# EAGLE design adapterSchematic (EAGLE 9.6.2)
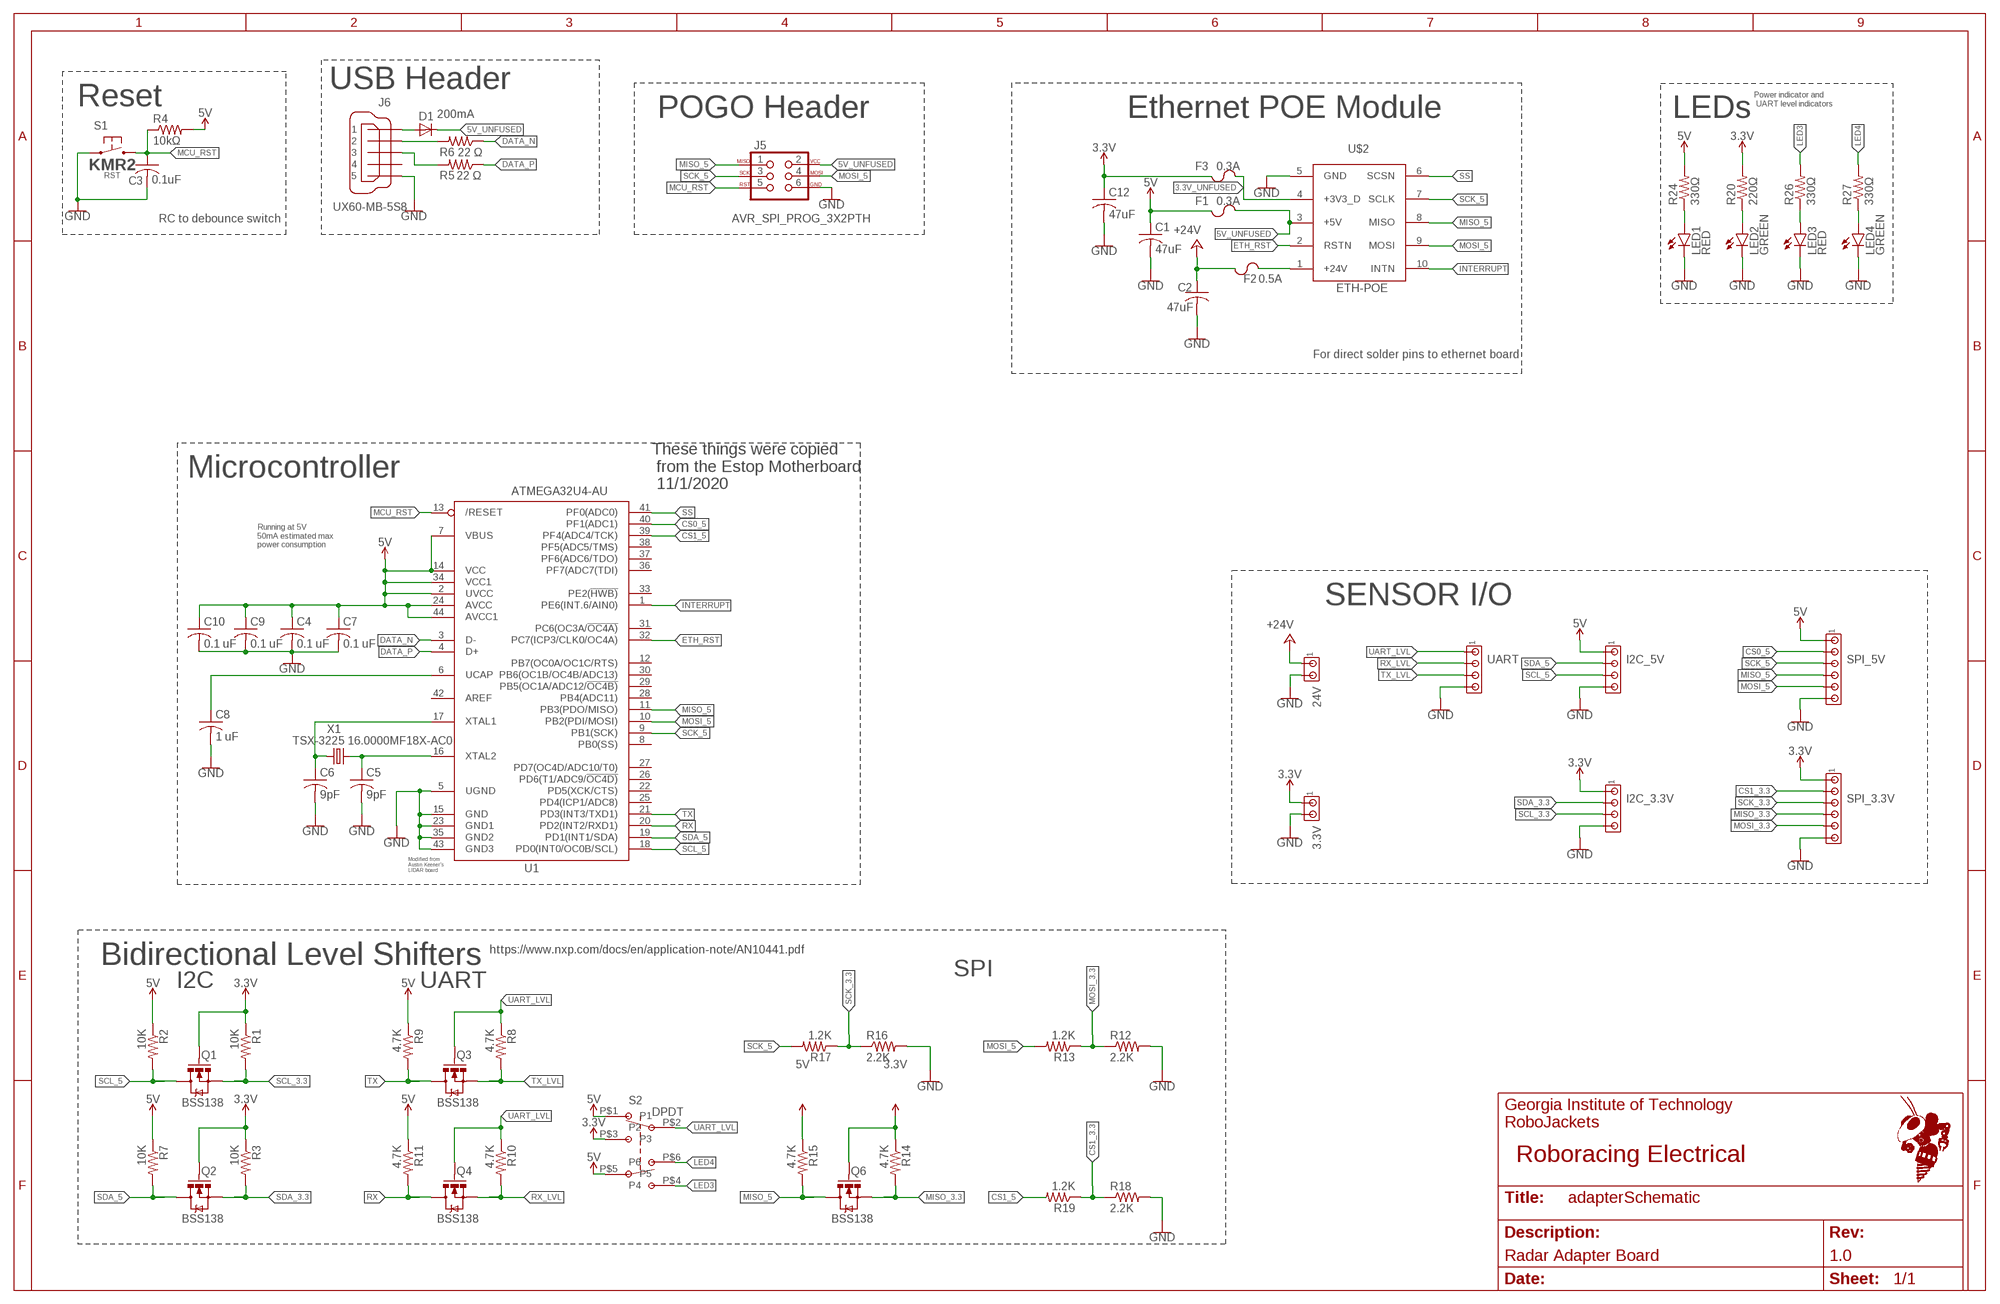
[diagram p0: schematic, sheet 1]
FRAME1 (FRAME_11_17): REVISION: 1.0; SCH_DESC: Radar Adapter Board; TEAM: Roboracing Electrical

## Parts
3.3V  MTA02-100  [10X02MTA]
24V  MTA02-100  [10X02MTA]
C1  47uF  C-USC1206  [C1206]
C2  47uF  C-USC1206  [C1206]
C3  0.1uF  C-USC0603  [C0603]
C4  0.1 uF  C-USC0603  [C0603]
C5  9pF  C-USC0603  [C0603]
C6  9pF  C-USC0603  [C0603]
C7  0.1 uF  C-USC0603  [C0603]
C8  1 uF  C-USC0603  [C0603]
C9  0.1 uF  C-USC0603  [C0603]
C10  0.1 uF  C-USC0603  [C0603]
C12  47uF  C-USC1206  [C1206]
D1  200mA  DIODE-SOD323-R  [SOD323-R]
F1  0.3A  CHIP_FUSE1206  [F1206]
F2  0.5A  CHIP_FUSE1206  [F1206]
F3  0.3A  CHIP_FUSE1206  [F1206]
I2C_3.3V  MTA04-100  [10X04MTA]
I2C_5V  MTA04-100  [10X04MTA]
J5  AVR_SPI_PROG_3X2PTH  [2X3]
J6  UX60-MB-5S8  [UX60-MB-5S8]
LED1  RED  LEDCHIP-LED0603  [CHIP-LED0603]
LED2  GREEN  LEDCHIP-LED0603  [CHIP-LED0603]
LED3  RED  LEDCHIP-LED0603  [CHIP-LED0603]
LED4  GREEN  LEDCHIP-LED0603  [CHIP-LED0603]
Q1  BSS138  MOSFET-NCHANNELSMD  [SOT23-3]
Q2  BSS138  MOSFET-NCHANNELSMD  [SOT23-3]
Q3  BSS138  MOSFET-NCHANNELSMD  [SOT23-3]
Q4  BSS138  MOSFET-NCHANNELSMD  [SOT23-3]
Q6  BSS138  MOSFET-NCHANNELSMD  [SOT23-3]
R1  10K  RESISTOR0603-RES  [0603-RES]
R2  10K  RESISTOR0603-RES  [0603-RES]
R3  10K  RESISTOR0603-RES  [0603-RES]
R4  10kΩ  R-US_R0603  [R0603]
R5  22 Ω  R-US_R0603  [R0603]
R6  22 Ω  R-US_R0603  [R0603]
R7  10K  RESISTOR0603-RES  [0603-RES]
R8  4.7K  RESISTOR0603-RES  [0603-RES]
R9  4.7K  RESISTOR0603-RES  [0603-RES]
R10  4.7K  RESISTOR0603-RES  [0603-RES]
R11  4.7K  RESISTOR0603-RES  [0603-RES]
R12  2.2K  RESISTOR0603-RES  [0603-RES]
R13  1.2K  RESISTOR0603-RES  [0603-RES]
R14  4.7K  RESISTOR0603-RES  [0603-RES]
R15  4.7K  RESISTOR0603-RES  [0603-RES]
R16  2.2K  RESISTOR0603-RES  [0603-RES]
R17  1.2K  RESISTOR0603-RES  [0603-RES]
R18  2.2K  RESISTOR0603-RES  [0603-RES]
R19  1.2K  RESISTOR0603-RES  [0603-RES]
R20  220Ω  R-US_R0603  [R0603]
R24  330Ω  R-US_R0603  [R0603]
R26  330Ω  R-US_R0603  [R0603]
R27  330Ω  R-US_R0603  [R0603]
S1  KMR2  [KMR2]
SPI_3.3V  MTA06-100  [10X06MTA]
SPI_5V  MTA06-100  [10X06MTA]
U1  ATMEGA32U4-AU  [TQFP44]
U$2  ETH-POE  [HDRVR10W64P4000X254_2X5_1016X508X254B]
U$4  DPDT_SLIDE_SWITCH  [DPDT_SLIDE_SWITCH]
UART  MTA04-100  [10X04MTA]
X1  TSX-3225 16.0000MF18X-AC0  XTAL-3.2X2.5  [XTAL-3.2X2.5]

## Nets
3.3V: 3.3V.1 C12.1 F3.1 I2C_3.3V.1 Q1.1(G) Q2.1(G) Q6.1(G) R1.1 R3.1 R14.1 R20.2 SPI_3.3V.1 U$4.P$3(P3)
3.3V_UNFUSED: F3.2 U$2.4(+3V3_D)
5V [power]: C1.1 C4.1 C7.1 C9.1 C10.1 F1.1 I2C_5V.1 R2.1 R4.2 R7.1 R9.1 R11.1 R15.1 R24.2 SPI_5V.1 U1.2(UVCC) U1.7(VBUS) U1.14(VCC) U1.24(AVCC) U1.34(VCC1) U1.44(AVCC1) U$4.P$1(P1) U$4.P$5(P5)
5V_UNFUSED [power]: D1.C F1.2 J5.2 U$2.3(+5V)
24V_UNFUSED: F2.2 U$2.1(+24V)
+24V: 24V.1 C2.1 F2.1
CS0_5: SPI_5V.2 U1.40(PF1(ADC1))
CS1_3.3: R18.1 R19.1 SPI_3.3V.2
CS1_5: R19.2 U1.39(PF4(ADC4/TCK))
DATA_N: R6.1 U1.3(D-)
DATA_P [RF]: R5.1 U1.4(D+)
ETH_RST: U1.32(PC7(ICP3/CLK0/OC4A)) U$2.2(RSTN)
GND [power]: 3.3V.2 24V.2 C1.2 C2.2 C3.2 C4.2 C5.2 C6.2 C7.2 C8.2 C9.2 C10.2 C12.2 I2C_3.3V.4 I2C_5V.4 J5.6 J6.5 LED1.C LED2.C LED3.C LED4.C R12.2 R16.2 R18.2 S1.1.1 S1.1.2 SPI_3.3V.6 SPI_5V.6 U1.5(UGND) U1.15(GND) U1.23(GND1) U1.35(GND2) U1.43(GND3) U$2.5(GND) UART.4
INTERRUPT: U1.1(PE6(INT.6/AIN0)) U$2.10(INTN)
LED3: R26.2 U$4.P$4(P4)
LED4: R27.2 U$4.P$6(P6)
MCU_RST: C3.1 J5.5 R4.1 S1.2.1 S1.2.2 U1.13(/RESET)
MISO_3.3: Q6.2(S) R14.2 SPI_3.3V.4
MISO_5: J5.1 Q6.3(D) R15.2 SPI_5V.4 U1.11(PB3(PDO/MISO)) U$2.8(MISO)
MOSI_3.3: R12.1 R13.1 SPI_3.3V.5
MOSI_5: J5.4 R13.2 SPI_5V.5 U1.10(PB2(PDI/MOSI)) U$2.9(MOSI)
N$1: LED2.A R20.1
N$3: LED1.A R24.1
N$4: LED3.A R26.1
N$5: J6.2 R6.2
N$7: D1.A J6.1
N$8: LED4.A R27.1
N$11: J6.3 R5.2
RX: Q4.3(D) R11.2 U1.20(PD2(INT2/RXD1))
RX_LVL: Q4.2(S) R10.2 UART.2
SCK_3.3: R16.1 R17.1 SPI_3.3V.3
SCK_5: J5.3 R17.2 SPI_5V.3 U1.9(PB1(SCK)) U$2.7(SCLK)
SCL_3.3: I2C_3.3V.3 Q1.2(S) R1.2
SCL_5: I2C_5V.3 Q1.3(D) R2.2 U1.18(PD0(INT0/OC0B/SCL))
SDA_3.3: I2C_3.3V.2 Q2.2(S) R3.2
SDA_5: I2C_5V.2 Q2.3(D) R7.2 U1.19(PD1(INT1/SDA))
SS: U1.41(PF0(ADC0)) U$2.6(SCSN)
TX: Q3.3(D) R9.2 U1.21(PD3(INT3/TXD1))
TX_LVL: Q3.2(S) R8.2 UART.3
UART_LVL: Q3.1(G) Q4.1(G) R8.1 R10.1 U$4.P$2(P2) UART.1
UCAP: C8.1 U1.6(UCAP)
XTAL1: C6.1 U1.17(XTAL1) X1.1
XTAL2: C5.1 U1.16(XTAL2) X1.3
Unconnected: J6.4 U1.8(PB0(SS)) U1.12(PB7(OC0A/OC1C/RTS)) U1.22(PD5(XCK/CTS)) U1.25(PD4(ICP1/ADC8)) U1.26(PD6(T1/ADC9/!OC4D)) U1.27(PD7(OC4D/ADC10/T0)) U1.28(PB4(ADC11)) U1.29(PB5(OC1A/ADC12/!OC4B)) U1.30(PB6(OC1B/OC4B/ADC13)) U1.31(PC6(OC3A/!OC4A)) U1.33(PE2(!HWB)) U1.36(PF7(ADC7(TDI)) U1.37(PF6(ADC6/TDO)) U1.38(PF5(ADC5/TMS)) U1.42(AREF)

## Notes on the sheet
- USB Header
- Reset
- Power indicator and
   UART level indicators
- POGO Header | Ethernet POE Module | LEDs
- RC to debounce switch
- For direct solder pins to ethernet board
- Microcontroller
- These things were copied
   from the Estop Motherboard 
   11/1/2020
- Running at 5V
  50mA estimated max
  power consumption
- SENSOR I/O
- Modified from 
  Austin Keener's 
  LIDAR board
- https://www.nxp.com/docs/en/application-note/AN10441.pdf
- Bidirectional Level Shifters
- SPI
- I2C | UART
- S2

## Library data of the parts
3.3V 24V = con-amp:MTA02-100: AMP connector
C1-C3 C12 = rcl:C-US: CAPACITOR, American symbol; SPICEPREFIX: C
C4-C10 = resistor:C-US: CAPACITOR, American symbol
D1 = RoboJackets-Diodes:DIODE-: DIODE
F1-F3 = RoboJackets-Fuses:CHIP_FUSE
I2C_3.3V I2C_5V UART = con-amp:MTA04-100: AMP connector
J5 = SparkFun-Connectors:AVR_SPI_PROG_3X2: AVR ISP 6 Pin This is the reduced ISP connector for AVR programming. Common on Arduino. This footprint will take up less PCB space and can be used with a 10-pin to 6-pin adapter such as SKU: BOB-08508 **Special note about "TEST_POINT" package. The stop mask is on the top side, so if you want your programming test points to be on the bottom of your board, make sure to place this package on the bottom side of the board. This also ensure that the orientation to program from the bottom side will be correct. SparkFun Products: SparkFun ISP Pogo Adapter <https://www.sparkfun.com/products/11591> - NS Tiny AVR Programmer <https://www.sparkfun.com/products/11801> -PTH
J6 = RoboJackets-Connectors:UX60*-MB-5S?: Mini USB Connector Brand: Hirose Electric Co Ltd <http://www.hirose.com/us/> Series: UX <http://www.digikey.com/product-search/en?FV=fff40016,fff802e4,ffec3225> Distributor: Digi-Key <http://www.digikey.com/product-detail/en/UX60A-MB-5ST/H2961CT-ND/597540>; PINS: 5
LED1-LED4 = led:LED: LED OSRAM: - CHIPLED LG R971, LG N971, LY N971, LG Q971, LY Q971, LO R971, LY R971 LH N974, LH R974 LS Q976, LO Q976, LY Q976 LO Q996 - Hyper CHIPLED LW Q18S LB Q993, LB Q99A, LB R99A - SideLED LS A670, LO A670, LY A670, LG A670, LP A670 LB A673, LV A673, LT A673, LW A673 LH A674 LY A675 LS A676, LA A676, LO A676, LY A676, LW A676 LS A679, LY A679, LG A679 - Hyper Micro SIDELED® LS Y876, LA Y876, LO Y876, LY Y876 LT Y87S - SmartLED LW L88C, LW L88S LB L89C, LB L89S, LG L890 LS L89K, LO L89K, LY L89K LS L896, LA L896, LO L896, LY L896 - TOPLED LS T670, LO T670, LY T670, LG T670, LP T670 LSG T670, LSP T670, LSY T670, LOP T670, LYG T670 LG T671, LOG T671, LSG T671 LB T673, LV T673, LT T673, LW T673 LH T674 LS T676, LA T676, LO T676, LY T676, LB T676, LH T676, LSB T676, LW T676 LB T67C, LV T67C, LT T67C, LS T67K, LO T67K, LY T67K, LW E67C LS E67B, LA E67B, LO E67B, LY E67B, LB E67C, LV E67C, LT E67C LW T67C LS T679, LY T679, LG T679 LS T770, LO T770, LY T770, LG T770, LP T770 LB T773, LV T773, LT T773, LW T773 LH T774 LS E675, LA E675, LY E675, LS T675 LS T776, LA T776, LO T776, LY T776, LB T776 LHGB T686 LT T68C, LB T68C - Hyper Mini TOPLED® LB M676 - Mini TOPLED Santana® LG M470 LS M47K, LO M47K, LY M47K Source: http://www.osram.convergy.de LUXEON: - LUMILED® LXK2-PW12-R00, LXK2-PW12-S00, LXK2-PW14-U00, LXK2-PW14-V00 LXK2-PM12-R00, LXK2-PM12-S00, LXK2-PM14-U00 LXK2-PE12-Q00, LXK2-PE12-R00, LXK2-PE12-S00, LXK2-PE14-T00, LXK2-PE14-U00 LXK2-PB12-K00, LXK2-PB12-L00, LXK2-PB12-M00, LXK2-PB14-N00, LXK2-PB14-P00, LXK2-PB14-Q00 LXK2-PR12-L00, LXK2-PR12-M00, LXK2-PR14-Q00, LXK2-PR14-R00 LXK2-PD12-Q00, LXK2-PD12-R00, LXK2-PD12-S00 LXK2-PH12-R00, LXK2-PH12-S00 LXK2-PL12-P00, LXK2-PL12-Q00, LXK2-PL12-R00 Source: www.luxeon.com KINGBRIGHT: KA-3528ASYC Source: www.kingbright.com
Q1-Q4 Q6 = SparkFun:MOSFET-NCHANNEL
R1-R3 R7-R19 = SparkFun:RESISTOR: Resistor Basic schematic elements and footprints for 0603, 1206, and PTH resistors.
R4-R6 R20 R24 R26 R27 = rcl:R-US_: RESISTOR, American symbol; SPICEPREFIX: R
S1 = RoboJackets-Switches:KMR2; FUNCTION: RST
SPI_3.3V SPI_5V = con-amp:MTA06-100: AMP connector Connection corrected 2014-09-19
U1 = estop-v1.0:ATMEGA32U4: http://www.ladyada.net/library/eagle
U$2 = ethernet_poe:ETH-POE: POE
U$4 = DPDT-slide-switch:DPDT_SLIDE_SWITCH
X1 = RoboJackets-FreqGen:XTAL

## Net classes
0 default: width 0.203 mm, drill 0.508 mm, clearance 0.178 mm
1 power: width 0.305 mm, drill 0.508 mm, clearance 0.178 mm
2 RF: width 0.203 mm, clearance 0.178 mm

## Board
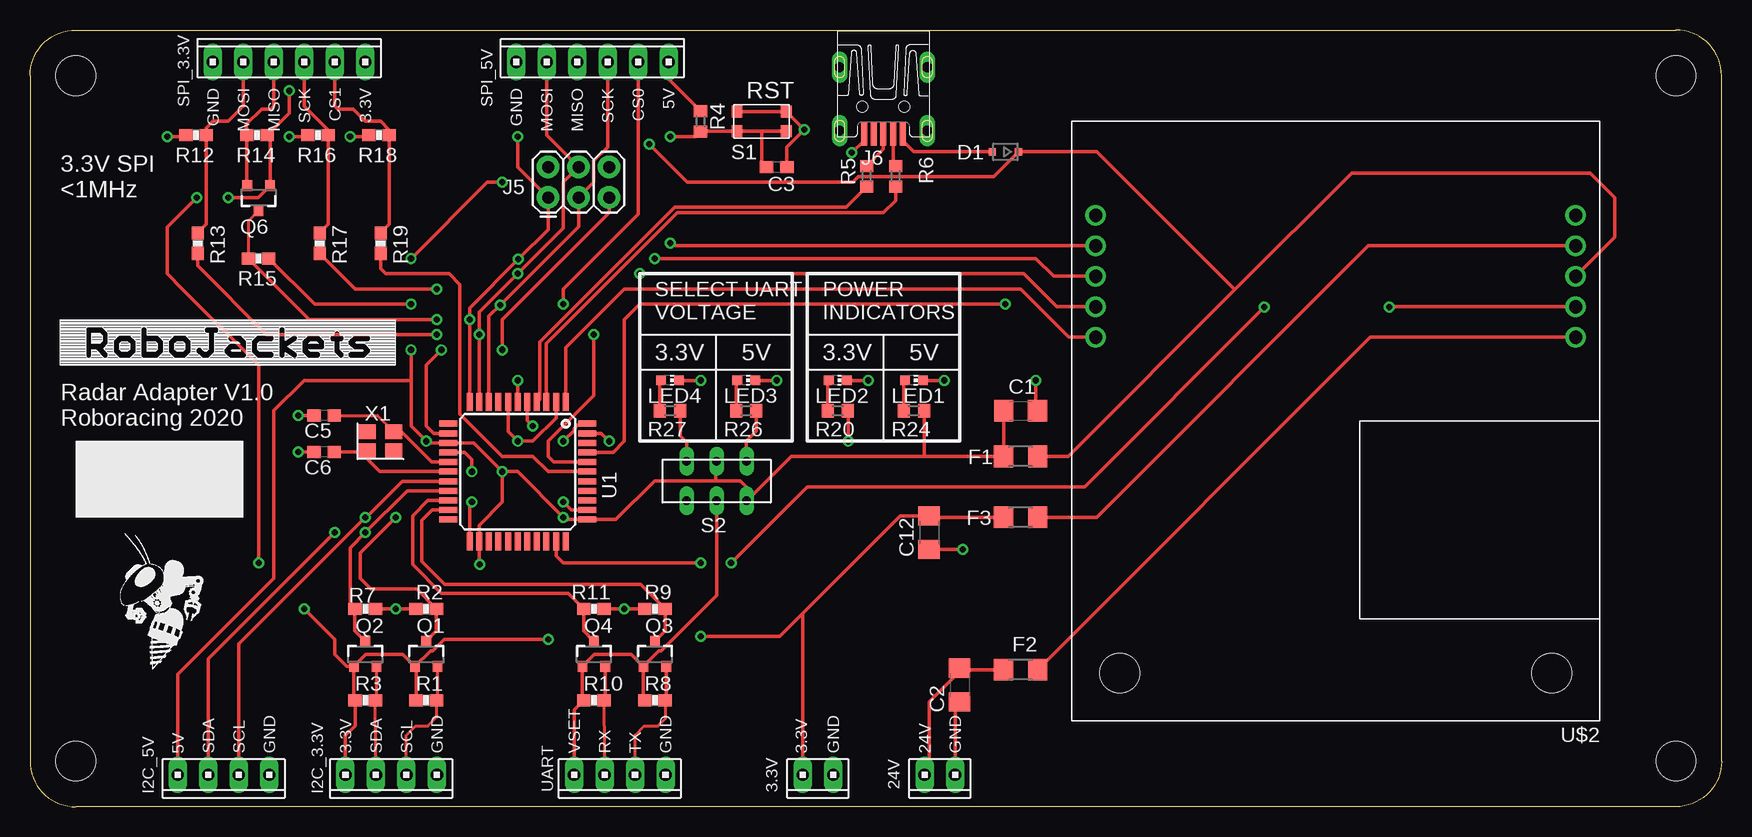
[diagram p1: board, top side]
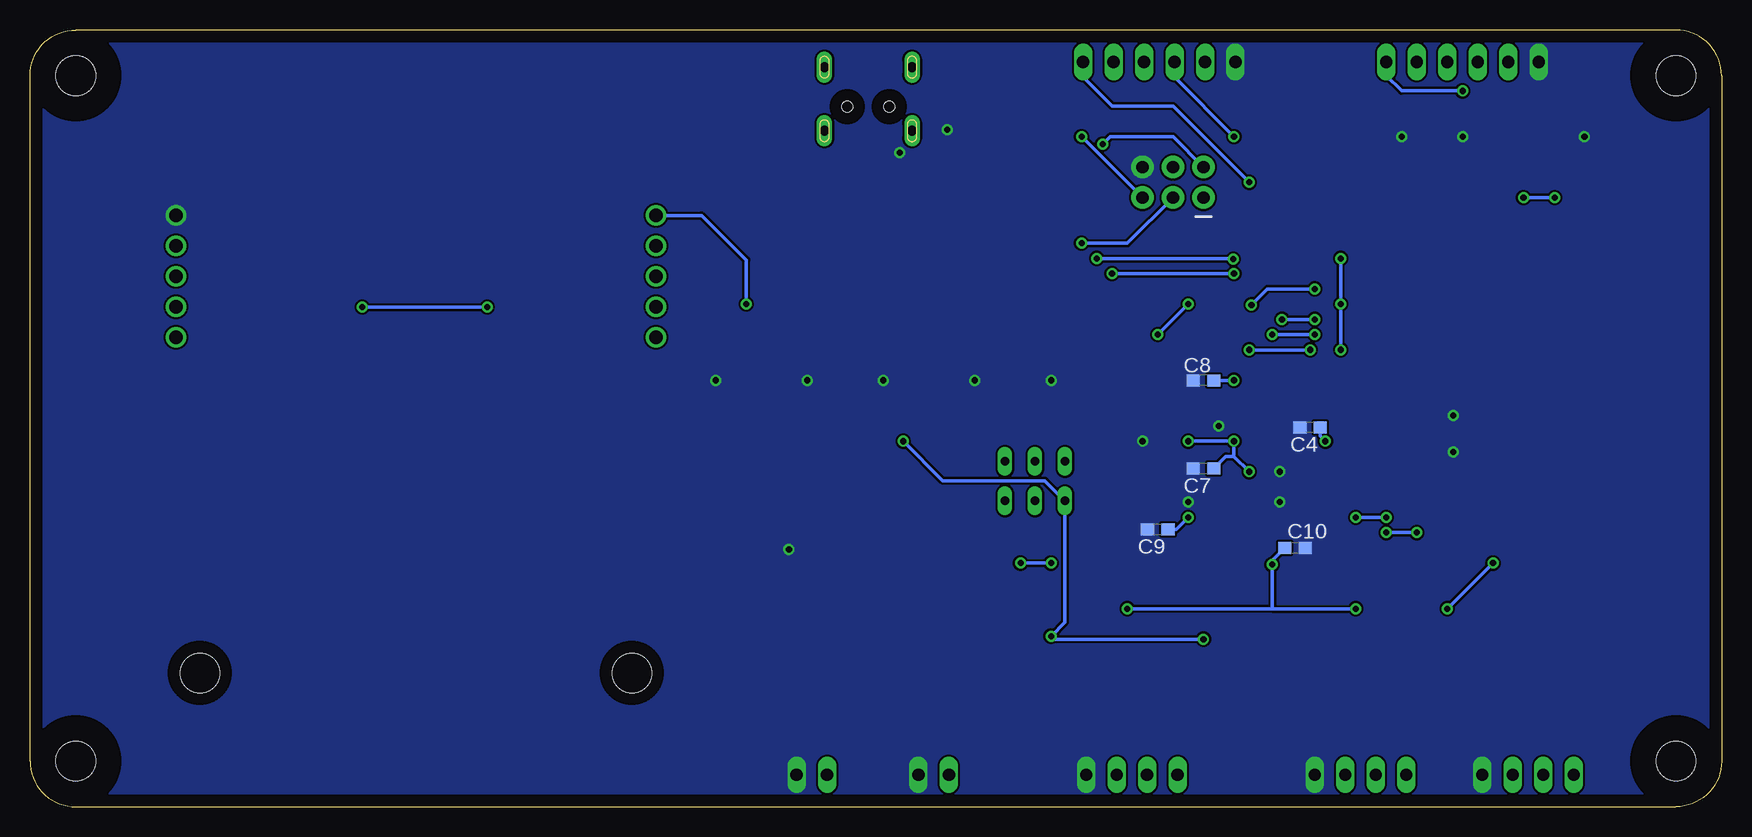
[diagram p2: board, bottom side, seen from below]

Size 140.97 x 64.77 mm. Coordinates in mm from the lower left corner, seen from the top.
Outline: 140.97,3.81 140.97,60.96 arc90 137.16,64.77 3.81,64.77 arc90 0,60.96 0,3.81 arc90 3.81,0 137.16,0 arc90 140.97,3.81
Copper layers (1*16): Top 0.035mm / dielectric 1.5mm / Bottom 0.035mm
Design rules "default *": minimum track width 6mil, minimum drill 0.35mm, track to track 6mil, track to pad 6mil, pad to pad 6mil, via to via 6mil, smd to smd 6mil, copper to edge 40mil, drill to drill 6mil, minimum pad ring 10mil, minimum via ring 8mil, stop-mask expansion 4mil, vias tented up to drill 0mil, thermal gap 10mil
Holes 3.3 mm at 3.81,60.96 3.81,3.81 137.16,60.96 137.16,3.81
bRestrict: area 0,57.1 to 7.6,64.8; area 0,0 to 7.6,7.6; area 133.3,0 to 141,7.6; area 133.3,57.1 to 141,64.8

### Footprints (pad centres in the part's own frame; a part is rotated, then mirrored left to right if it is on the bottom)
10X02MTA = drill 1.016 long: 1 1.27,0; 2 -1.27,0
C1206 = smd 1.6 x 1.8: 1 -1.4,0; 2 1.4,0
C0603 = smd 1.1 x 1: 1 -0.85,0; 2 0.85,0
SOD323-R = smd 0.6 x 0.6: A 1.1,0; C -1.1,0
F1206 = smd 1.6 x 1.803: 1 -1.422,0; 2 1.422,0
10X04MTA = drill 1.016 long: 1 3.81,0; 2 1.27,0; 3 -1.27,0; 4 -3.81,0
2X3 = drill 1.016 pad 1.88: 1 0,0; 2 0,2.54; 3 2.54,0; 4 2.54,2.54; 5 5.08,0; 6 5.08,2.54
UX60-MB-5S8 = smd 2 x 0.5: 1 8.65,1.6; 2 8.65,0.8; 3 8.65,0; 4 8.65,-0.8; 5 8.65,-1.6 | drill 0.8 long: M1 3.1,-3.65; M2 3.1,3.65; M3 8.4,3.65; M4 8.4,-3.65 | hole 0.9: 6.4,-1.75; 6.4,1.75
CHIP-LED0603 = smd 0.8 x 0.8: A 0,-0.75; C 0,0.75
SOT23-3 = smd 0.8 x 0.9: 1 -0.95,-1; 2 0.95,-1; 3 0,1.1
0603-RES = smd 1.1 x 1: 1 -0.85,0; 2 0.85,0
R0603 = smd 1 x 1.1: 1 -0.85,0; 2 0.85,0
KMR2 = smd 0.9 x 1: 1.1 -2.05,0.8; 1.2 2.05,0.8; 2.1 -2.05,-0.8; 2.2 2.05,-0.8
10X06MTA = drill 1.016 long: 1 6.35,0; 2 3.81,0; 3 1.27,0; 4 -1.27,0; 5 -3.81,0; 6 -6.35,0
TQFP44 = smd 1.5 x 0.5: 1 -5.8,4; 2 -5.8,3.2; 3 -5.8,2.4; 4 -5.8,1.6; 5 -5.8,0.8; 6 -5.8,0; 7 -5.8,-0.8; 8 -5.8,-1.6; 9 -5.8,-2.4; 10 -5.8,-3.2; 11 -5.8,-4; 23 5.8,-4; 24 5.8,-3.2; 25 5.8,-2.4; 26 5.8,-1.6; 27 5.8,-0.8; 28 5.8,0; 29 5.8,0.8; 30 5.8,1.6; 31 5.8,2.4; 32 5.8,3.2; 33 5.8,4 | smd 0.5 x 1.5: 12 -4,-5.8; 13 -3.2,-5.8; 14 -2.4,-5.8; 15 -1.6,-5.8; 16 -0.8,-5.8; 17 0,-5.8; 18 0.8,-5.8; 19 1.6,-5.8; 20 2.4,-5.8; 21 3.2,-5.8; 22 4,-5.8; 34 4,5.8; 35 3.2,5.8; 36 2.4,5.8; 37 1.6,5.8; 38 0.8,5.8; 39 0,5.8; 40 -0.8,5.8; 41 -1.6,5.8; 42 -2.4,5.8; 43 -3.2,5.8; 44 -4,5.8
HDRVR10W64P4000X254_2X5_1016X508X254B = drill 1.105 pad 1.705: 1 2,18; 2 2,15.46; 3 2,12.92; 4 2,10.38; 5 2,7.84; 6 42,7.84; 7 42,10.38; 8 42,12.92; 9 42,15.46; 10 42,18 | hole 3.3: 4,46; 40,46
DPDT_SLIDE_SWITCH = drill 0.7 long: P$1 2,3.45; P$2 4.5,3.45; P$3 7,3.45; P$4 2,0.15; P$5 4.5,0.15; P$6 7,0.15
XTAL-3.2X2.5 = smd 1.4 x 1.2: 1 -1.1,-0.8; 2 1.1,-0.8; 3 1.1,0.8; 4 -1.1,0.8

### Placement (x,y rotation side)
3.3V  65.66,2.67 180 top
24V  75.82,2.67 180 top
C1  82.55,33.02 0 top
C2  77.47,10.16 270 top
C3  62.23,53.34 0 top
C4  34.29,31.62 180 bottom
C5  24.51,32.64 180 top
C6  24.51,29.59 180 top
C7  43.18,28.19 180 bottom
C8  43.18,35.56 180 bottom
C9  46.99,23.11 180 bottom
C10  35.56,21.59 0 bottom
C12  74.93,22.86 270 top
D1  81.28,54.61 180 top
F1  82.55,29.21 0 top
F2  82.55,11.43 0 top
F3  82.55,24.13 0 top
I2C_3.3V  30.1,2.67 180 top
I2C_5V  16.13,2.67 180 top
J5  43.18,50.8 0 top
J6  71.12,64.77 270 top
LED1  73.66,35.56 270 top
LED2  67.31,35.56 270 top
LED3  59.69,35.56 270 top
LED4  53.34,35.56 270 top
Q1  33.02,12.7 0 top
Q2  27.94,12.7 0 top
Q3  52.07,12.7 0 top
Q4  46.99,12.7 0 top
Q6  19.05,50.8 180 top
R1  33.02,8.89 0 top
R2  33.02,16.51 0 top
R3  27.94,8.89 0 top
R4  55.88,57.15 90 top
R5  69.72,52.58 90 top
R6  72.14,52.58 90 top
R7  27.94,16.51 180 top
R8  52.07,8.89 0 top
R9  52.07,16.51 0 top
R10  46.99,8.89 0 top
R11  46.99,16.51 180 top
R12  13.84,56.01 180 top
R13  13.97,46.99 270 top
R14  18.92,56.01 180 top
R15  19.05,45.72 180 top
R16  24,56.01 180 top
R17  24.13,46.99 270 top
R18  29.08,56.01 180 top
R19  29.21,46.99 270 top
R20  67.31,33.02 0 top
R24  73.66,33.02 0 top
R26  59.69,33.02 0 top
R27  53.34,33.02 0 top
S1  60.96,57.15 0 top
SPI_3.3V  21.59,62.1 0 top
SPI_5V  46.86,62.1 0 top
U1  40.64,27.94 270 top
U$1  [ROBOBUZZ_0.6X]  10.16,11.43 0 top
U$2  130.81,57.15 180 top
U$3  [ROBOJACKETS]  2.54,36.83 0 top
U$4  61.72,28.96 180 top
UART  49.15,2.67 180 top
X1  29.21,30.48 0 top

### Tracks (layer width: path | path; a pad name or v marks a point on that pad's centre or on a via)
3.3V  (via drill 0.51)
  Top 0.305: I2C_3.3V.1 26.29,5.97 27.09,6.77 R3.1 26.99,8.99 Q2.1 | Q2.1 27.99,12.7 31.07,12.7 Q1.1 | Q1.1 32.17,11.6 R1.1 | F3.1 75.06,24.13 C12.1 72.52,24.26 64.39,16.13 | v55.88,14.22 62.48,14.22 64.39,16.13 | 3.3V.1 64.39,16.13 | v19.05,20.32 19.05,36.83 12.7,43.18 11.43,44.45 11.43,48.32 v13.91,50.8 | v22.86,16.51 25.4,13.97 25.4,12.7 26.4,11.7 Q2.1 | Q1.1 33.39,13.02 33.56,13.02 34.51,13.97 v43.18,13.97 | v68.2,30.48 68.2,32.98 R20.2 | v16.51,50.8 19,50.8 Q6.1 20,55.78 R14.1 21.59,57.82 v21.59,59.69
  Bottom 0.305: v19.05,20.32 v22.86,16.51 | v43.18,13.97 55.63,13.97 v55.88,14.22 54.72,15.38 U$4.P$3 56.39,27.18 64.9,27.18 v68.2,30.48 | v13.91,50.8 v16.51,50.8 | v21.59,59.69 26.67,59.69 27.94,60.96 SPI_3.3V.1
3.3V_UNFUSED
  Top 0.305: U$2.4 111.54,46.77 88.9,24.13 F3.2
5V  (via drill 0.51)
  Top 0.305: v39.37,27.94 40.64,27.94 v44.45,24.13 44.64,23.94 U1.34 48.83,23.94 52.07,27.18 57.15,27.18 | v37.47,20.19 37.44,20.22 U1.24 37.44,23.47 39.37,25.4 v39.37,27.94 | R2.1 v30.48,16.51 R7.1 | R9.1 v49.53,16.51 R11.1 | U1.7 39.84,31.28 v40.64,30.48 41.91,30.48 43.84,32.41 U1.2 | 57.15,27.18 59.18,27.18 59.72,26.64 U$4.P$1 63.43,29.21 74.55,29.21 | 57.15,27.18 57.15,28.73 U$4.P$5 | v44.45,30.48 45.36,31.39 45.36,31.53 45.77,31.94 U1.44 | v39.37,27.94 36.97,30.34 U1.14 33.16,30.34 v33.02,30.48 31.75,31.75 31.75,35.56 | 31.75,35.56 v31.75,38.1 | R4.2 53.21,60.67 SPI_5V.1 | I2C_5V.1 12.32,11.05 20.32,19.05 20.32,33.02 22.86,35.56 31.75,35.56 | C1.1 81.15,29.23 F1.1 74.55,29.21 | R24.2 74.51,29.25 74.55,29.21 | v39.37,52.07 38.1,52.07 v31.75,45.72 | v31.75,41.91 23.71,41.91 R15.1
  Bottom 0.305: 37.47,16.51 v37.47,20.19 37.47,20.54 C10.1 | 37.47,16.51 v49.53,16.51 | 37.47,16.51 v30.48,16.51 | 40.64,29.21 v40.64,30.48 v44.45,30.48 | 40.64,29.21 v39.37,27.94 | v31.75,38.1 v31.75,41.91 v31.75,45.72 | C9.1 45.47,23.11 v44.45,24.13 | C7.1 41.31,29.21 40.64,29.21 | C4.1 33.44,30.9 v33.02,30.48 | v39.37,52.07 45.72,58.42 50.8,58.42 53.21,60.83 SPI_5V.1
5V_UNFUSED  (via drill 0.51)
  Top 0.305: U$2.3 132.08,47.5 132.08,50.8 130.03,52.85 110.15,52.85 100.41,43.1 | 100.41,43.1 86.51,29.21 F1.2 | 100.41,43.1 88.9,54.61 D1.C 80.33,52.56 69.04,52.56 68.55,52.07 54.76,52.07 v51.59,55.24
  Bottom 0.305: J5.2 45.72,55.88 50.95,55.88 v51.59,55.24
24V_UNFUSED
  Top 0.305: F2.2 111.69,39.15 U$2.1
+24V
  Top 0.305: F2.1 77.6,11.43 C2.1 77.47,11.31 74.93,8.76 74.93,3.05 24V.1
CS0_5  (via drill 0.51)
  Top 0.305: U1.40 43.65,28.74 43.18,29.21 43.18,30.48 46.99,34.29 v46.99,39.37 | v44.45,41.91 44.45,43.18 50.67,49.4 SPI_5V.2
  Bottom 0.305: v46.99,39.37 v44.45,41.91
CS1_3.3
  Top 0.305: SPI_3.3V.2 25.4,58.42 25.65,58.17 26.67,58.17 26.92,58.17 27.94,57.15 29.21,57.15 29.93,56.43 R18.1 29.93,48.56 R19.1
CS1_5
  Top 0.305: U1.39 43.18,27.94 41.91,29.21 39.37,29.21 35.81,32.77 35.81,43.56 34.92,44.45 29.63,44.45 29.21,44.87 R19.2
DATA_N
  Top 0.305: R6.1 72.14,50.55 71.12,49.53 53.93,49.53 43.04,38.64 U1.3
DATA_P
  Top 0.305: U1.4 42.46,33.96 42.46,38.74 53.73,50.01 68.01,50.01 R5.1
ETH_RST  (via drill 0.51)
  Top 0.305: U$2.2 113.32,41.69 v113.28,41.66 | v102.87,41.66 87.88,26.67 64.77,26.67 v58.42,20.32 | v55.88,20.32 44.45,20.32 43.84,20.93 U1.32
  Bottom 0.305: v113.28,41.66 v102.87,41.66 | v58.42,20.32 v55.88,20.32
GND  (via drill 0.51)
  Top 0.305: C5.2 v22.35,32.64 | C6.2 v22.35,29.59 | LED4.C v55.88,35.56 | LED3.C v62.23,35.56 | 24V.2 77.09,8.38 C2.2 77.6,8.89 | C12.2 v77.72,21.46 | U1.43 47.6,31.14 v48.26,30.48 | U1.15 36.25,29.54 36.83,28.96 v36.83,27.94 | U1.23 36.64,25.21 v36.83,25.4 | U1.35 45.11,24.74 v44.45,25.4 | U1.5 41.44,32.22 v41.91,31.75 | C3.2 63.08,55 v64.52,56.44 S1.1.2 S1.1.1 | J6.5 69.52,55.55 v68.5,54.53 | C1.2 83.82,33.15 v83.82,35.56 | LED2.C v69.85,35.56 | LED1.C v76.2,35.56 | R18.2 28.11,55.88 v26.67,55.88 | R12.2 12.87,55.88 v11.43,55.88 | R16.2 23.03,55.88 v21.59,55.88
  pour Bottom (no thermals): 142.24,-2.54 -2.54,-2.54 -2.54,66.04 142.24,66.04
INTERRUPT
  Top 0.305: U$2.10 86.58,39.15 82.55,43.18 49.53,43.18 44.64,38.29 U1.1
LED3
  Top 0.305: U$4.P$4 59.69,28.84 59.69,30.48 60.54,31.33 R26.2
LED4
  Top 0.305: U$4.P$6 54.72,30.37 54.19,30.9 R27.2
MCU_RST  (via drill 0.51)
  Top 0.305: J5.5 48.26,49.53 39.37,40.64 v39.37,38.1 | U1.13 33.63,31.14 33.02,31.75 33.02,36.83 v34.29,38.1 | S1.2.2 60.96,56.35 | 60.96,56.35 S1.2.1 55.93,56.35 R4.1 55.46,55.88 v53.34,55.88 | C3.1 60.96,53.76 60.96,56.35
  Bottom 0.305: v39.37,38.1 v34.29,38.1 | v53.34,55.88 J5.5
MISO_3.3
  Top 0.254: Q6.2 18.07,51.83 | 18.03,56.05 R14.2
  Top 0.305: R14.2 18.07,51.83 | SPI_3.3V.4 20.32,58.42 20.07,58.17 19.3,58.17 18.03,56.9 18.03,56.05
MISO_5  (via drill 0.51)
  Top 0.254: Q6.3 18.2,48.85 R15.2
  Top 0.305: U$2.8 85.31,44.23 83.82,45.72 v52.07,45.72 | U1.11 v36.64,40.64 36.64,41.59 v40.7,45.66 43.18,48.13 J5.1 40.64,53.34 v40.64,55.88 | v33.91,40.64 23.28,40.64 R15.2
  Bottom 0.305: v52.07,45.72 40.77,45.72 v40.7,45.66 | v33.91,40.64 v36.64,40.64 | SPI_5V.4 45.59,60.83 v40.64,55.88
MOSI_3.3
  Top 0.254: 17.78,58.42 17.53,58.17
  Top 0.305: SPI_3.3V.5 17.78,58.42 | 17.53,58.17 16.51,57.15 15.24,57.15 14.69,56.6 R12.1 14.69,48.56 R13.1
MOSI_5  (via drill 0.51)
  Top 0.305: SPI_5V.5 43.05,56.01 J5.4 44.45,52.07 44.45,48.26 v40.64,44.45 37.44,41.25 v37.44,39.37 U1.10 | U$2.9 85.56,41.69 82.8,44.45 v50.8,44.45 | v33.91,39.37 19.71,39.37 13.97,45.11 R13.2
  Bottom 0.305: v50.8,44.45 v40.64,44.45 | v33.91,39.37 v37.44,39.37
N$1
  Top 0.305: LED2.A 66.46,35.46 R20.1
N$3
  Top 0.305: LED1.A 72.81,35.46 R24.1
N$4
  Top 0.305: R26.1 58.84,35.46 LED3.A
N$5
  Top 0.305: R6.2 71.92,53.64 J6.2
N$7
  Top 0.305: D1.A 73.66,54.61 72.72,55.55 J6.1
N$8
  Top 0.305: R27.1 52.49,35.46 LED4.A
N$11
  Top 0.305: R5.2 71.12,54.83 J6.3
RX
  Top 0.305: U1.20 33.16,25.54 31.88,24.26 31.88,20.19 34.29,17.78 44.87,17.78 R11.2 46.14,14.65 Q4.3
RX_LVL
  Top 0.254: UART.2 47.88,6.73 47.84,6.77 R10.2
  Top 0.305: Q4.2 47.94,8.99 R10.2
SCK_3.3
  Top 0.305: SPI_3.3V.3 22.86,58.42 24.85,56.43 R16.1 24.85,48.56 R17.1
SCK_5  (via drill 0.51)
  Top 0.305: SPI_5V.3 48.13,55.01 46.99,53.87 46.99,52.07 J5.3 45.72,48.39 v39.18,41.85 38.24,40.91 U1.9 | v33.91,43.18 27.09,43.18 R17.2 | v53.34,46.99 53.56,46.77 U$2.7
  Bottom 0.305: v33.91,43.18 37.85,43.18 v39.18,41.85 | v53.34,46.99 49.53,46.99 J5.3
SCL_3.3
  Top 0.254: I2C_3.3V.3 31.37,5.97 32.13,6.73 33.15,6.73 33.91,7.49 33.91,8.85 R1.2 33.97,8.99 Q1.2
SCL_5  (via drill 0.51)
  Top 0.305: Q1.3 33.87,14.65 R2.2 32.22,18.16 28.41,18.16 27.52,19.05 27.52,21.17 v30.48,24.13 | U1.18 31.03,27.14 28.02,24.13 v27.94,24.13 17.4,13.59 I2C_5V.3
  Bottom 0.305: v27.94,24.13 v30.48,24.13
SDA_3.3
  Top 0.254: I2C_3.3V.2 28.83,6.73 28.79,6.77 R3.2 28.89,8.99 Q2.2
SDA_5  (via drill 0.51)
  Top 0.305: U1.19 31.42,26.34 v27.94,22.86 26.67,21.59 26.67,16.93 R7.2 27.07,16.59 27.07,14.67 Q2.3 | v25.4,22.86 14.86,12.32 I2C_5V.2
  Bottom 0.305: v27.94,22.86 v25.4,22.86
SS  (via drill 0.51)
  Top 0.305: v81.28,41.91 50.8,41.91 49.53,40.64 49.53,30.48 48.59,29.54 U1.41
  Bottom 0.305: U$2.6 85,49.31 81.28,45.59 v81.28,41.91
TX
  Top 0.305: Q3.3 52.92,14.65 R9.2 50.89,18.54 34.54,18.54 32.64,20.45 32.64,23.88 33.5,24.74 U1.21
TX_LVL
  Top 0.254: UART.3 50.42,5.97 51.18,6.73 52.32,6.73 52.96,7.37 52.96,8.85 R8.2
  Top 0.305: Q3.2 53.02,8.99 R8.2
UART_LVL
  Top 0.305: 51.09,11.72 50.12,12.7 47.04,12.7 Q4.1 46.04,8.99 R10.1 45.34,8.09 UART.1 | 51.09,11.72 Q3.1 51.12,8.99 R8.1 | 51.09,11.72 52.39,13.02 52.61,13.02 57.22,17.64 U$4.P$2
UCAP  (via drill 0.51)
  Top 0.305: U1.6 v40.64,35.56
  Bottom 0.305: v40.64,35.56 C8.1
XTAL1
  Top 0.305: U1.17 29.16,27.94 28.02,29.08 28.02,29.59 | C6.1 28.02,29.59 | 28.02,29.59 X1.1
XTAL2
  Top 0.254: X1.3 28.95,32.64 C5.1
  Top 0.305: X1.3 30.95,31.28 33.49,28.74 U1.16

### Text on the board
tPlace: 3.3V SPI / <1MHz | SELECT UART / VOLTAGE | POWER / INDICATORS | 3.3V | 5V | 3.3V | 5V | Radar Adapter V1.0 / Roboracing 2020
tNames: GND | MOSI | MISO | SCK | CS1 | 3.3V | GND | MOSI | MISO | SCK | CS0 | 5V | R26 | S2 | 5V | SDA | SCL | GND | 3.3V | SDA | SCL | GND | VSET | RX | TX | GND | 3.3V | GND | 24V | GND